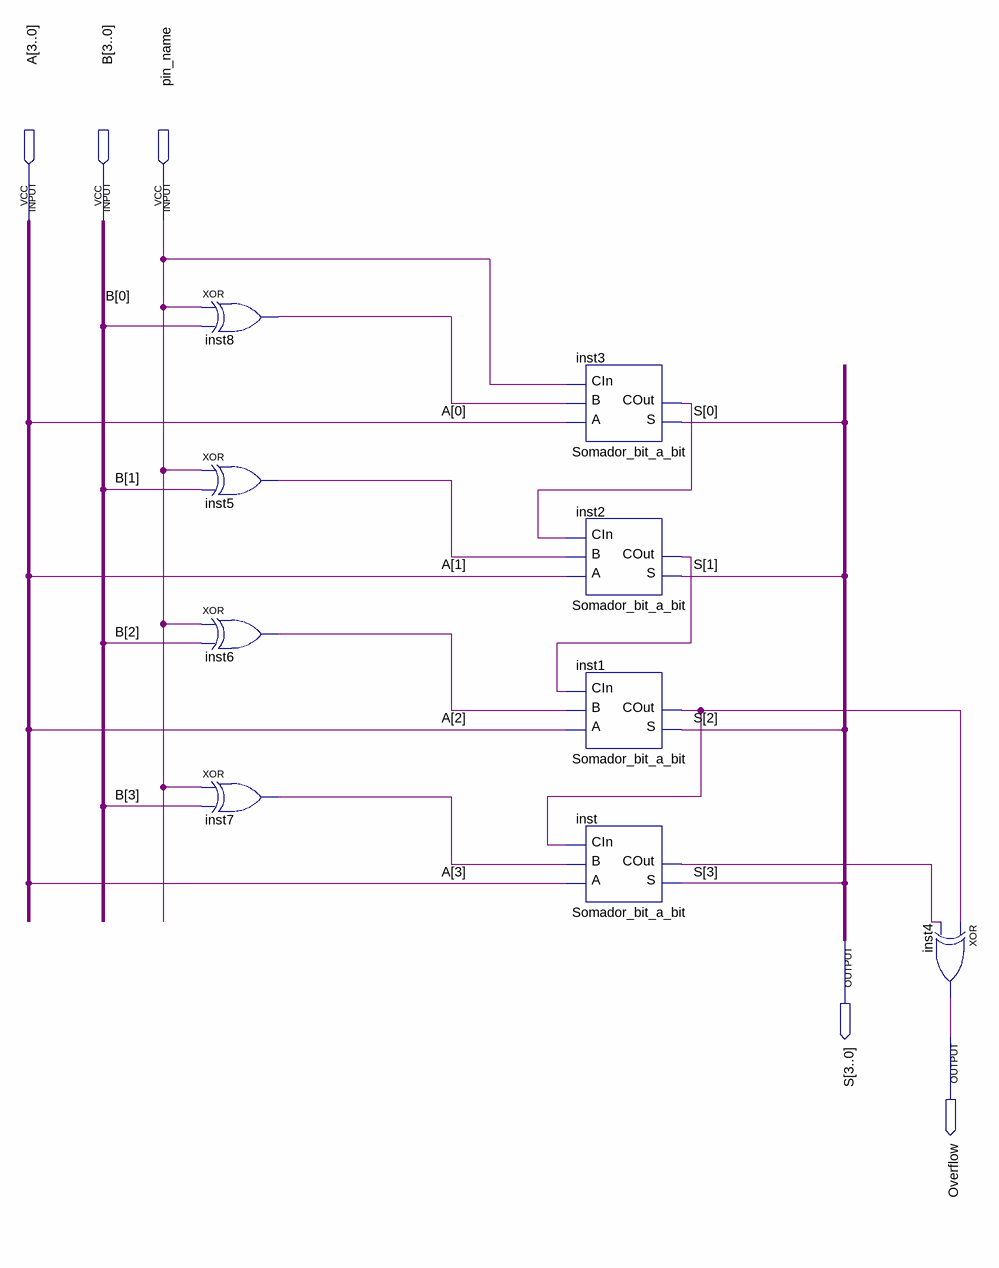
[diagram p0: schematic sheet]
// Quartus schematic Somador_completo.bdf as structural Verilog: 9 symbols, 5 pins
module Somador_completo (
  input  [3:0] A,
  input  [3:0] B,
  input  pin_name,
  output [3:0] S,
  output Overflow
);

  wire inst1_cout, inst2_cout, inst3_cout, inst5_out, inst6_out, inst7_out, inst8_out, inst_cout;

  xor inst8 (inst8_out, pin_name, B[0]);
  xor inst5 (inst5_out, pin_name, B[1]);
  xor inst6 (inst6_out, pin_name, B[2]);
  xor inst7 (inst7_out, pin_name, B[3]);
  Somador_bit_a_bit inst3 (.A(A[0]), .B(inst8_out), .CIn(pin_name), .S(S[0]), .COut(inst3_cout));
  Somador_bit_a_bit inst2 (.A(A[1]), .B(inst5_out), .CIn(inst3_cout), .S(S[1]), .COut(inst2_cout));
  Somador_bit_a_bit inst1 (.A(A[2]), .B(inst6_out), .CIn(inst2_cout), .S(S[2]), .COut(inst1_cout));
  Somador_bit_a_bit inst (.A(A[3]), .B(inst7_out), .CIn(inst1_cout), .S(S[3]), .COut(inst_cout));
  xor inst4 (Overflow, inst1_cout, inst_cout);
endmodule
